# EAGLE design Minisumo_edu (EAGLE 7.1.0)
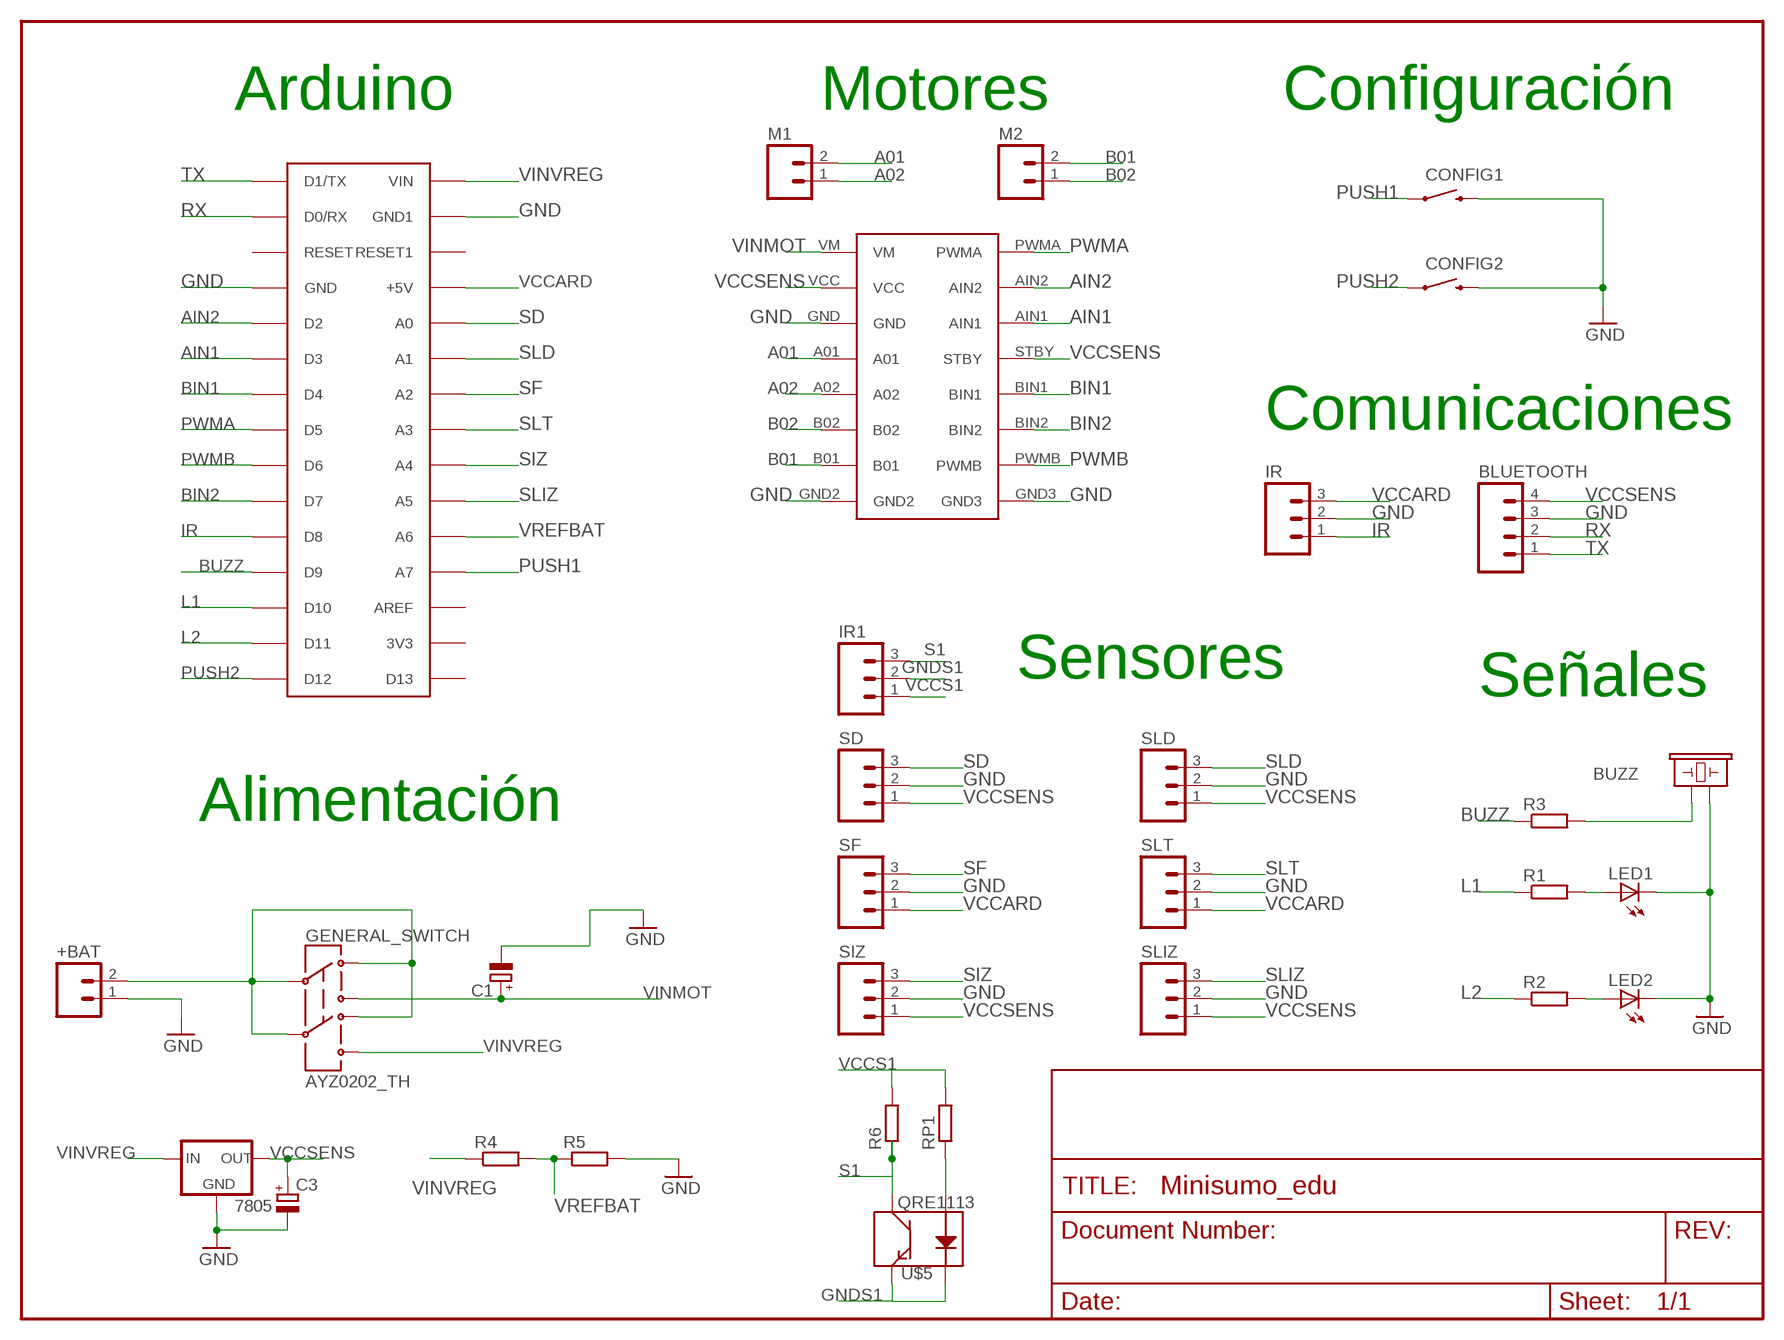
[diagram p0: schematic, sheet 1]

## Parts
7805  V_REG_78XXSINK  [TO220-IGO]
+BAT  M02LOCK_LONGPADS  [1X02_LOCK_LONGPADS]
BLUETOOTH  M04LONGPADS  [1X04_LONGPADS]
BUZZ  BUZZERPTH  [BUZZER-12MM]
C1  CPOL-EUE2.5-6  [E2,5-6]
C3  CPOL-EUE2.5-6  [E2,5-6]
CONFIG1  SWITCH-MOMENTARY-2PTH  [TACTILE-PTH]
CONFIG2  SWITCH-MOMENTARY-2PTH  [TACTILE-PTH]
GENERAL_SWITCH  AYZ0202_TH  [AYZ0202_TH]
IR  M03LONGPADS  [1X03_LONGPADS]
IR1  M03LONGPADS  [1X03_LONGPADS]
LED1  LED3MM  [LED3MM]
LED2  LED3MM  [LED3MM]
M1  M02LOCK_LONGPADS  [1X02_LOCK_LONGPADS]
M2  M02LOCK_LONGPADS  [1X02_LOCK_LONGPADS]
R1  R-EU_0207/7  [0207/7]
R2  R-EU_0207/7  [0207/7]
R3  R-EU_0207/7  [0207/7]
R4  R-EU_0207/7  [0207/7]
R5  R-EU_0207/7  [0207/7]
R6  R-EU_M0805  [M0805@1]
RP1  R-EU_M0805  [M0805]
SD  M03LONGPADS  [1X03_LONGPADS]
SF  M03LONGPADS  [1X03_LONGPADS]
SIZ  M03LONGPADS  [1X03_LONGPADS]
SLD  M03LONGPADS  [1X03_LONGPADS]
SLIZ  M03LONGPADS  [1X03_LONGPADS]
SLT  M03LONGPADS  [1X03_LONGPADS]
U$1  ARDUINONANO  [PDIP-32]
U$3  TB6612FNG_SPARKFUN  [TB6612FNG_SPARKFUN]
U$5  QRE1113  [QRE1113]

## Nets
A01: M1.2 U$3.A01
A02: M1.1 U$3.A02
AIN1: U$1.D3 U$3.AIN1
AIN2: U$1.D2 U$3.AIN2
B01: M2.2 U$3.B01
B02: M2.1 U$3.B02
BIN1: U$1.D4 U$3.BIN1
BIN2: U$1.D7 U$3.BIN2
BUZZ: R3.1 U$1.D9
GND: 7805.GND +BAT.1 BLUETOOTH.3 BUZZ.- C1.- C3.- CONFIG1.3 CONFIG2.3 IR.2 LED1.K(C) LED2.K(C) R5.2 SD.2 SF.2 SIZ.2 SLD.2 SLIZ.2 SLT.2 U$1.GND U$1.GND1 U$3.GND U$3.GND2 U$3.GND3
GNDS1: IR1.2 U$5.2(K) U$5.4(E)
IR: IR.1 U$1.D8
L1: R1.1 U$1.D10
L2: R2.1 U$1.D11
N$1: +BAT.2 GENERAL_SWITCH.C1 GENERAL_SWITCH.C2 GENERAL_SWITCH.D1 GENERAL_SWITCH.D2
N$2: LED1.A R1.2
N$3: BUZZ.+ R3.2
N$5: LED2.A R2.2
N$7: RP1.1 U$5.1(A)
PUSH1: CONFIG1.1 U$1.A7
PUSH2: CONFIG2.1 U$1.D12
PWMA: U$1.D5 U$3.PWMA
PWMB: U$1.D6 U$3.PWMB
RX: BLUETOOTH.2 U$1.D0/RX
S1: IR1.3 R6.1 U$5.3(C)
SD: SD.3 U$1.A0
SF: SF.3 U$1.A2
SIZ: SIZ.3 U$1.A4
SLD: SLD.3 U$1.A1
SLIZ: SLIZ.3 U$1.A5
SLT: SLT.3 U$1.A3
TX: BLUETOOTH.1 U$1.D1/TX
VCCARD: IR.3 SF.1 SLT.1 U$1.+5V
VCCS1: IR1.1 R6.2 RP1.2
VCCSENS: 7805.OUT BLUETOOTH.4 C3.+ SD.1 SIZ.1 SLD.1 SLIZ.1 U$3.STBY U$3.VCC
VINMOT: C1.+ GENERAL_SWITCH.B1 U$3.VM
VINVREG: 7805.IN GENERAL_SWITCH.B2 R4.1 U$1.VIN
VREFBAT: R4.2 R5.1 U$1.A6
Unconnected: U$1.3V3 U$1.AREF U$1.D13 U$1.RESET U$1.RESET1

## Notes on the sheet
- Arduino | Motores | Configuración
- Comunicaciones
- Sensores | Señales
- Alimentación

## Library data of the parts
7805 = SparkFun:V_REG_78XX: Voltage Regulator Standard 7805 5V regulator. IGO (Input Ground Output). Spark Fun Electronics SKU : COM-00107
+BAT M1 M2 = SparkFun:M02: Header 2 Standard 2-pin 0.1" header. Use with straight break away headers (SKU : PRT-00116), right angle break away headers (PRT-00553), swiss pins (PRT-00743), machine pins (PRT-00117), and female headers (PRT-00115). Molex polarized connector foot print use with SKU : PRT-08233 with associated crimp pins and housings.
BLUETOOTH = SparkFun:M04: Header 4 Standard 4-pin 0.1" header. Use with straight break away headers (SKU : PRT-00116), right angle break away headers (PRT-00553), swiss pins (PRT-00743), machine pins (PRT-00117), and female headers (PRT-00115). Molex polarized connector foot print use with SKU : PRT-08231 with associated crimp pins and housings. 1MM SMD Version SKU: PRT-10208
BUZZ = SparkFun:BUZZER: Buzzer 12mm Spark Fun Electronics SKU : Comp-Buzzer
C1 C3 = rcl:CPOL-EU: POLARIZED CAPACITOR, European symbol
CONFIG1 CONFIG2 = SparkFun:SWITCH-MOMENTARY-2
GENERAL_SWITCH = 1r_BAT_guissona:AYZ0202_TH
IR IR1 SD SF SIZ SLD SLIZ SLT = SparkFun:M03: Header 3 Standard 3-pin 0.1" header. Use with straight break away headers (SKU : PRT-00116), right angle break away headers (PRT-00553), swiss pins (PRT-00743), machine pins (PRT-00117), and female headers (PRT-00115). Molex polarized connector foot print use with SKU : PRT-08232 with associated crimp pins and housings.
LED1 LED2 = SparkFun:LED: LEDs Standard schematic elements and footprints for 5mm, 3mm, 1206, and 0603 sized LEDs. 5mm - Spark Fun Electronics SKU : COM-00529 (and others)
R1-R5 RP1 = rcl:R-EU_: RESISTOR, European symbol
R6 = resistor:R-EU_: RESISTOR, European symbol
U$1 = jet-lib:ARDUINONANO
U$3 = 1r_BAT_guissona:TB6612FNG_SPARKFUN
U$5 = SparkFun:QRE1113

## Board
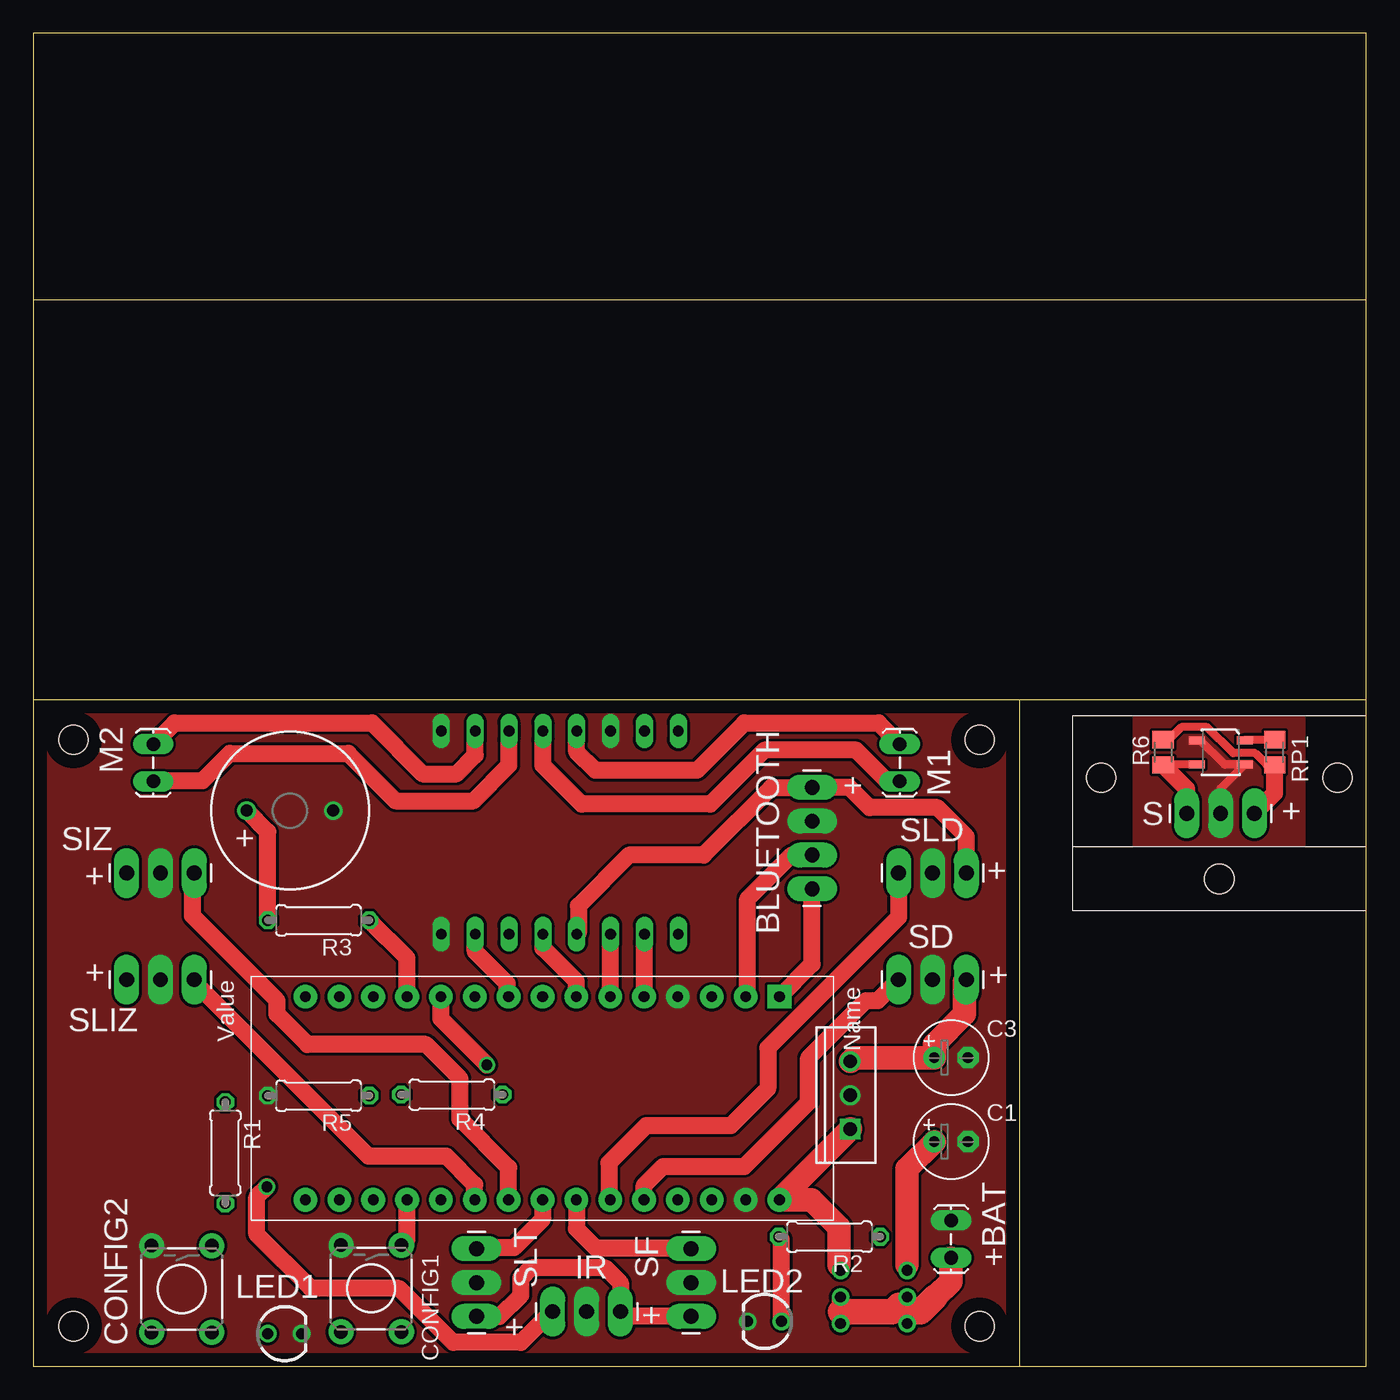
[diagram p1: board, top side]
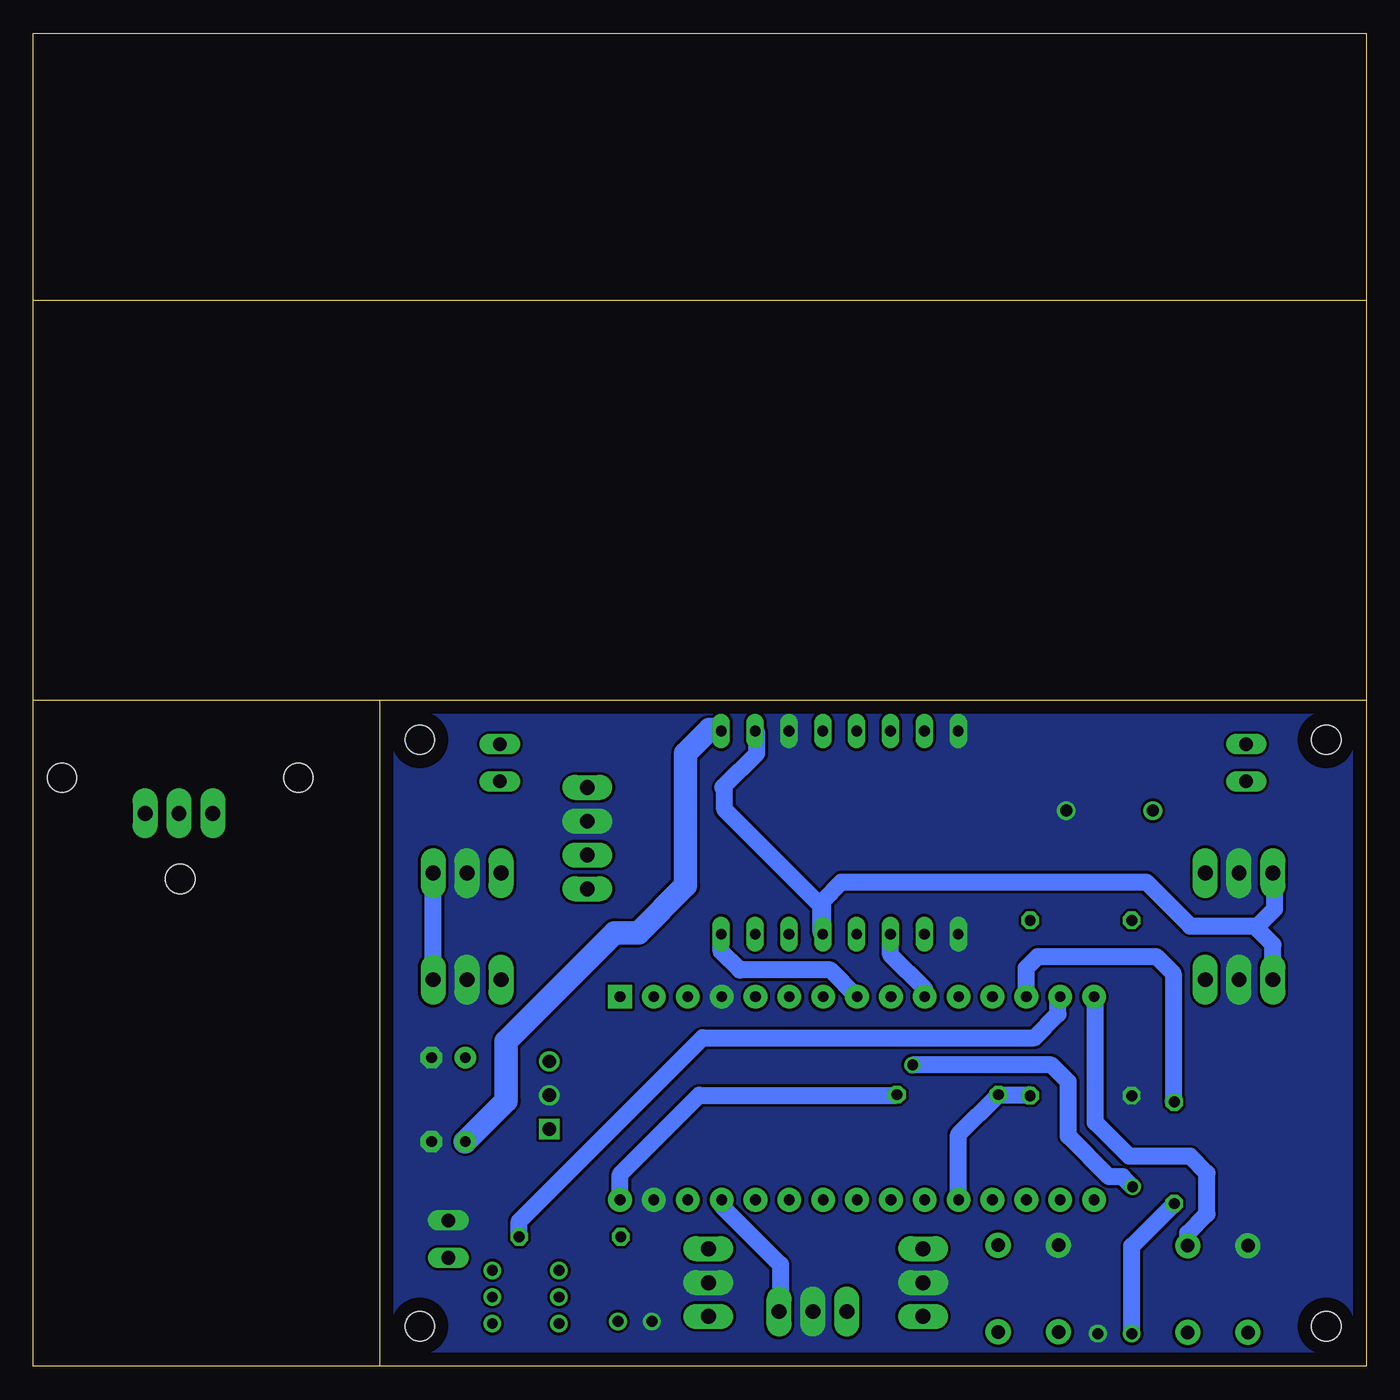
[diagram p2: board, bottom side, seen from below]

Size 100 x 100 mm. Coordinates in mm from the lower left corner, seen from the top.
Outline: 74,0 0,0 0,50
Outline: 74,0 100,0 100,50
Outline: 100,50 100,80
Outline: 100,80 100,100 0,100 0,80
Outline: 0,80 0,50
Outline: 100,80 0,80
Outline: 100,50 74,50
Outline: 74,50 0,50
Outline: 74,0 74,50
Copper layers (1*16): Top 0.035mm / dielectric 1.5mm / Bottom 0.035mm
Design rules "default": minimum track width 10mil, minimum drill 24mil, track to track 8mil, track to pad 8mil, pad to pad 8mil, via to via 8mil, smd to smd 8mil, copper to edge 40mil, drill to drill 8mil, minimum pad ring 10mil, minimum via ring 8mil, stop-mask expansion 4mil, vias tented up to drill 0mil, thermal gap 10mil
Holes 2.2 mm at 3,3 71,3 3,47 71,47 80.12,44.16 97.85,44.16 88.98,36.56

### Footprints (pad centres in the part's own frame; a part is rotated, then mirrored left to right if it is on the bottom)
TO220-IGO = drill 1: GND 0,0; OUT 2.54,0 | drill 1 square: IN -2.54,0
1X02_LOCK_LONGPADS = drill 1.016 long: 1 -0.127,0; 2 2.667,0
1X04_LONGPADS = drill 1.118 pad 1.88 long: 1 0,0; 2 2.54,0; 3 5.08,0; 4 7.62,0
BUZZER-12MM = drill 0.9: + 3.25,0; - -3.25,0
E2,5-6 = drill 0.813 pad 1.6: + -1.27,0 | drill 0.813 pad 1.6 octagon: - 1.27,0
TACTILE-PTH = drill 1.016 pad 1.88: 1 -3.251,2.261; 2 3.251,2.261; 3 -3.251,-2.261; 4 3.251,-2.261
AYZ0202_TH = drill 0.8: B1 -2.5,-2; B2 2.5,-2; C1 -2.5,0; C2 2.5,0; D1 -2.5,2; D2 2.5,2
1X03_LONGPADS = drill 1.118 pad 1.88 long: 1 0,0; 2 2.54,0; 3 5.08,0
LED3MM = drill 0.813: A -1.27,0; K 1.27,0
0207/7 = drill 0.813 octagon: 1 -3.81,0; 2 3.81,0
M0805@1 = smd 1.3 x 1.6: 1 -0.95,0; 2 0.95,0
M0805 = smd 1.3 x 1.6: 1 -0.95,0; 2 0.95,0
PDIP-32 = drill 0.8 pad 1.778: 3V3 15.24,-35.56; +5V 15.24,-10.16; A0 15.24,-12.7; A1 15.24,-15.24; A2 15.24,-17.78; A3 15.24,-20.32; A4 15.24,-22.86; A5 15.24,-25.4; A6 15.24,-27.94; A7 15.24,-30.48; AREF 15.24,-33.02; D0/RX 0,-5.08; D2 0,-12.7; D3 0,-15.24; D4 0,-17.78; D5 0,-20.32; D6 0,-22.86; D7 0,-25.4; D8 0,-27.94; D9 0,-30.48; D10 0,-33.02; D11 0,-35.56; D12 0,-38.1; D13 15.24,-38.1; GND 0,-10.16; GND1 15.24,-5.08; RESET 0,-7.62; RESET1 15.24,-7.62; VIN 15.24,-2.54 | drill 0.8 pad 1.778 square: D1/TX 0,-2.54
TB6612FNG_SPARKFUN = drill 0.8 long: A01 -7.62,1.27; A02 -7.62,-1.27; AIN1 7.62,3.81; AIN2 7.62,6.35; B01 -7.62,-6.35; B02 -7.62,-3.81; BIN1 7.62,-1.27; BIN2 7.62,-3.81; GND -7.62,3.81; GND2 -7.62,-8.89; GND3 7.62,-8.89; PWMA 7.62,8.89; PWMB 7.62,-6.35; STBY 7.62,1.27; VCC -7.62,6.35; VM -7.62,8.89
QRE1113 = smd 1.2 x 0.6: 1 -1.8,-0.9; 2 1.8,-0.9; 3 1.8,0.9; 4 -1.8,0.9

### Placement (x,y rotation side)
7805  61.29,20.33 90 top
+BAT  68.86,10.8 270 top
BLUETOOTH  58.43,35.81 90 top
BUZZ  19.26,41.68 180 top
C1  68.86,16.85 0 top
C3  68.86,23.15 0 top
CONFIG1  25.35,5.83 270 top
CONFIG2  11.13,5.79 270 top
GENERAL_SWITCH  63.06,5.19 180 top
IR  38.97,4.1 0 top
IR1  91.62,41.48 180 top
LED1  18.86,2.44 0 top
LED2  54.86,3.36 180 top
M1  65,44 90 top
M2  9,44 90 top
R1  14.4,16.01 270 top
R2  59.73,9.71 180 top
R3  21.4,33.45 180 top
R4  31.4,20.37 180 top
R5  21.4,20.29 180 top
R6  84.76,46.05 90 top
RP1  93.14,46.05 270 top
SD  70,29 180 top
SF  49.36,3.73 90 top
SIZ  7,37 0 top
SLD  70,37 180 top
SLIZ  7,29 0 top
SLT  33.25,3.73 90 top
U$1  58.52,27.72 270 top
U$3  39.5,40.04 270 top
U$5  89.08,46.05 180 top

### Tracks (layer width: path | path; a pad name or v marks a point on that pad's centre or on a via)
A01
  Top 1.27: U$3.A01 40.77,46.1 42.16,44.7 49.78,44.7 53.34,48.26 63.41,48.26 M1.2
A02
  Top 1.27: M1.1 64.93,43.94 64.01,43.94 61.72,46.23 54.86,46.23 50.8,42.16 41.15,42.16 38.23,45.08 U$3.A02
AIN1
  Top 1.27: U$1.D3 43.31,27.72 U$3.AIN1
AIN2
  Top 1.27: U$1.D2 45.85,27.72 U$3.AIN2
B01
  Top 1.27: M2.2 10.59,48.26 25.4,48.26 29.21,44.45 31.75,44.45 33.15,45.85 U$3.B01
B02
  Top 1.27: M2.1 9.07,43.94 12.7,43.94 14.73,45.97 23.62,45.97 27.18,42.42 33.02,42.42 35.69,45.09 U$3.B02
BIN1
  Top 1.27: U$1.D4 40.74,28.86 38.23,31.37 U$3.BIN1
BIN2
  Bottom 1.27: U$1.D7 33.12,28.29 35.69,30.86 U$3.BIN2
BUZZ
  Top 1.27: U$1.D9 28.04,30.62 R3.1
GND
  pour Top (no thermals): 0,0 74,0 74,50 0,50
  pour Bottom (no thermals): 0,0 74,0 74,50 0,50
GNDS1
  Top 0.61: IR1.2 89.08,43.35 U$5.4 90.23,45.15 90.22,45.14 89.38,45.14 87.57,46.95 U$5.2
  pour Top (no thermals): 82.5,38.96 95.43,38.96 95.43,48.79 82.5,48.79
IR  (via drill 0.8)
  Top 1.27: IR.1 38.9,4.1 36.58,1.78 31.5,1.78 27.43,5.84 20.83,5.84 16.76,9.91 16.76,12.7 v17.53,13.46 | v34.04,22.61 30.58,26.06 U$1.D8
  Bottom 1.27: v17.53,13.46 18.29,14.22 19.3,14.22 22.35,17.27 22.35,21.34 23.62,22.61 v34.04,22.61
L1
  Bottom 1.27: U$1.D10 25.5,29.87 24.64,30.73 15.75,30.73 14.48,29.46 14.48,19.9 R1.1
L2
  Bottom 1.27: R2.1 63.54,10.88 49.78,24.64 24.89,24.64 23.11,26.42 23.11,27.57 U$1.D11
N$1
  Top 1.27: GENERAL_SWITCH.D2 60.56,4.06 GENERAL_SWITCH.C2 | GENERAL_SWITCH.D1 65.56,4.06 65.56,4.57 GENERAL_SWITCH.C1 | 68.83,8.11 +BAT.2
  Top 1.778: 67.67,5.19 68.83,6.35 68.83,8.11
  Top 1.93: 67.67,5.19 66.55,4.06 65.56,4.06 | 60.56,4.06 64.43,4.06 64.94,4.57 65.56,4.57
N$2
  Bottom 1.27: LED1.A 17.59,9.01 R1.2
N$3
  Top 1.27: R3.2 17.59,40.1 BUZZ.+
N$5
  Top 1.27: LED2.A 56.13,9.5 R2.2
N$7
  Top 0.61: U$5.1 90.93,47 RP1.1
PUSH1
  Top 1.27: CONFIG1.1 28.04,9.51 U$1.A7
PUSH2
  Bottom 1.27: CONFIG2.1 13.39,9.98 11.94,11.43 11.94,14.48 13.21,15.75 17.78,15.75 20.32,18.29 20.32,27.62 U$1.D12
PWMA
  Bottom 1.27: U$1.D5 40.2,29.72 46.99,29.72 48.39,31.12 U$3.PWMA
PWMB
  Top 1.27: U$1.D6 35.56,27.82 35.56,28.7 33.15,31.11 U$3.PWMB
RX
  Top 1.27: U$1.D0/RX 53.59,27.87 53.59,35.05 56.89,38.35 BLUETOOTH.2
S1
  Top 0.61: U$5.3 84.81,45.15 R6.1
  Top 1.27: IR1.3 86.54,43.32 R6.1
SD
  Top 1.27: U$1.A0 45.82,13.56 47.24,14.99 53.34,14.99 58.17,19.81 58.17,23.11 62.48,27.43 63.35,27.43 SD.3
SF
  Top 1.27: U$1.A2 40.74,10.31 42.16,8.89 49.28,8.89 SF.3
SIZ
  Top 1.27: U$1.A4 35.66,14.89 32,18.54 32,21.59 29.46,24.13 20.57,24.13 18.29,26.42 18.29,27.43 11.94,33.78 11.94,36.86 SIZ.3
SLD
  Top 1.27: SLD.3 64.92,33.68 55.12,23.88 55.12,20.83 52.32,18.03 45.97,18.03 43.18,15.24 43.18,12.58 U$1.A1
SLIZ
  Top 1.27: U$1.A5 33.12,13.62 30.99,15.75 25.15,15.75 12.08,28.81 SLIZ.3
SLT
  Top 1.27: U$1.A3 38.2,11.02 36.07,8.89 33.33,8.89 SLT.3
TX
  Top 1.27: U$1.D1/TX 58.43,30.17 BLUETOOTH.1
VCCARD
  Top 1.27: SF.1 44.42,3.73 IR.3 44.05,6.24 42.93,7.37 37.34,7.37 36.58,6.6 36.58,5.33 34.97,3.73 SLT.1
  Bottom 1.27: U$1.+5V 48.36,12.04 43.94,7.62 43.94,4.21 IR.3
VCCS1
  Top 0.61: RP1.2 92.54,45.1 92.54,45.13 91.67,46 90.02,46 88.06,47.95 86.13,47.95 85.18,47 R6.2
  Top 1.27: IR1.1 93.14,43 RP1.2
VCCSENS
  Top 1.27: SLD.1 70,39.73 67.82,41.91 62.74,41.91 61.21,43.43 BLUETOOTH.4 55.37,43.43 50.29,38.35 44.7,38.35 40.89,34.54 40.89,32.54 U$3.STBY
  Top 1.778: 7805.OUT 61.57,23.15 C3.+ 67.59,24.16 69.85,26.42 69.85,28.85 SD.1
  Bottom 1.27: BLUETOOTH.4 | 48.26,43.43 48.13,43.56 | 48.13,43.56 45.72,45.97 45.72,47.53 U$3.VCC | 48.13,43.56 48.13,41.78 40.89,34.54 40.89,32.54 U$3.STBY 40.77,34.92 39.37,36.32 16.51,36.32 13.21,33.02 8.38,33.02 | SD.1 SLD.1 | 8.38,33.02 8.13,33.02 6.86,34.29 6.86,36.86 SIZ.1 | SLIZ.1 7,31.64 8.38,33.02
VINMOT
  Top 1.27: GENERAL_SWITCH.B1 65.53,7.19 65.53,7.62
  Top 1.778: 65.53,7.62 65.53,14.79 C1.+
  Bottom 1.27: 49.02,47.75 48.93,47.66 U$3.VM
  Bottom 1.778: C1.+ 64.52,19.92 64.52,24.38 56.39,32.51 54.61,32.51 51.05,36.07 51.05,45.97 49.28,47.75 49.02,47.75
VINVREG
  Top 1.27: 60.45,7.62 60.45,7.3 GENERAL_SWITCH.B2
  Top 1.778: 7805.IN U$1.VIN 58.39,12.48 60.45,10.41 60.45,7.62
  Bottom 1.27: U$1.VIN 55.98,14.38 50.04,20.32 35.26,20.32 R4.1
VREFBAT
  Bottom 1.27: R5.1 25.29,20.37 R4.2 30.58,17.38 U$1.A6

### Text on the board
tNames: + | S | + | + | + | + | + | + | +